# EAGLE schematic untitled (EAGLE 6.3)
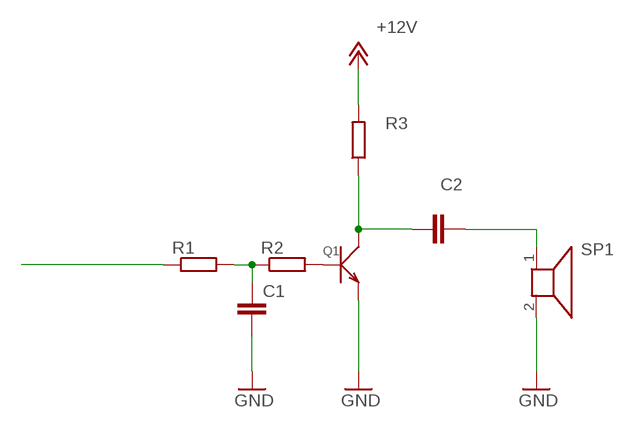
[diagram p0: schematic, sheet 1]

## Parts
C1  C-EU025-024X044  [C025-024X044]
C2  C-EU025-024X044  [C025-024X044]
Q1  TRANSISTOR-NPN-1.27  [NPN1.27]
R1  R-EU_0207/2V  [0207/2V]
R2  R-EU_0207/2V  [0207/2V]
R3  R-EU_0207/2V  [0207/2V]
SP1  AL60P  [AL60P]

## Nets
+12V: R3.2
GND: C1.2 Q1.E SP1.2
N$1: Q1.B R2.2
N$2: C1.1 R1.2 R2.1
N$3: C2.1 Q1.C R3.1
N$4: C2.2 SP1.1
N$5: R1.1

## Library data of the parts
C1 C2 = rcl:C-EU: CAPACITOR, European symbol
Q1 = Discrete:TRANSISTOR-NPN*: NPN audion
R1-R3 = rcl:R-EU_: RESISTOR, European symbol
SP1 = buzzer:AL60P: SPEAKER Source: Buerklin; OC_FARNELL: unknown; OC_NEWARK: unknown